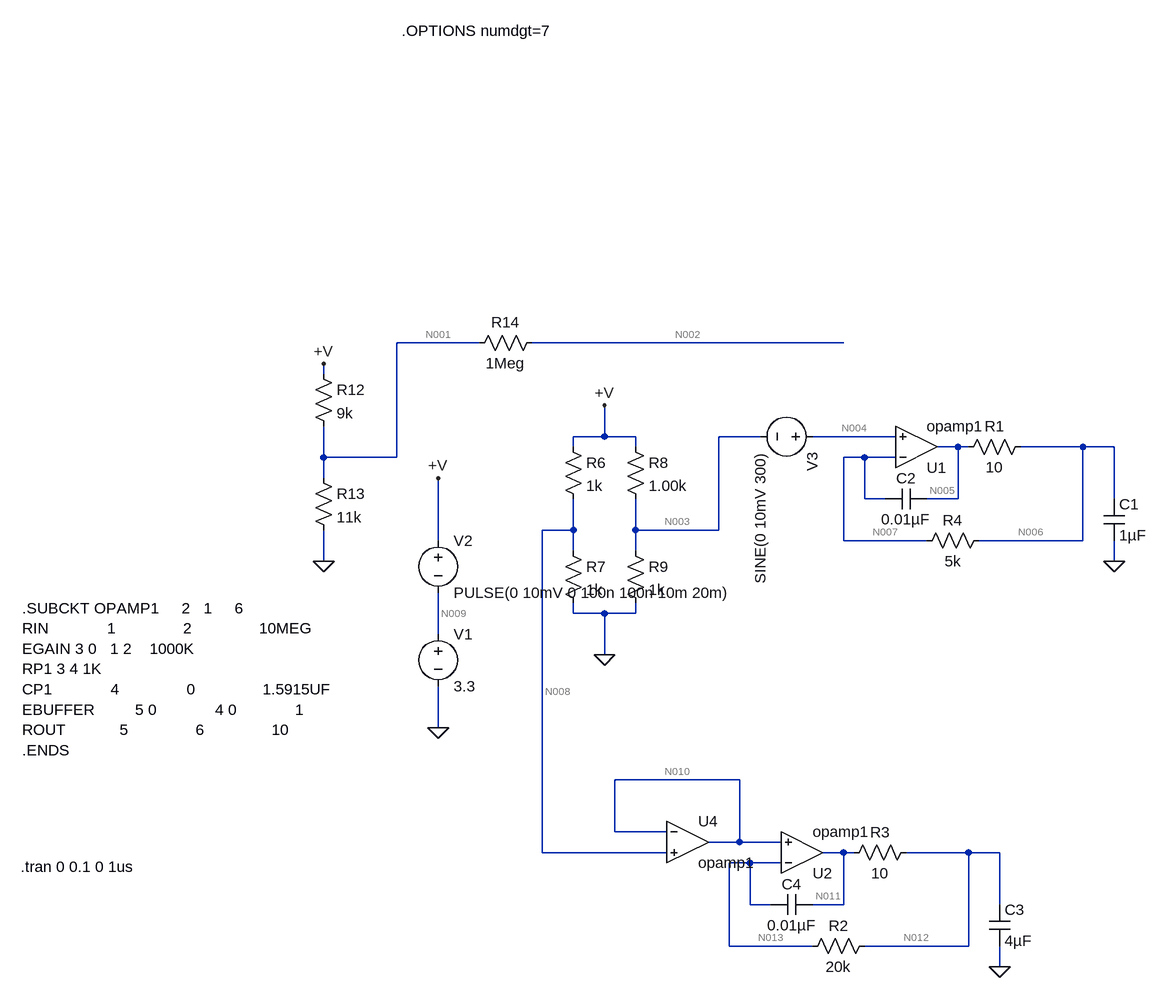
[diagram p0: schematic amp02.asc]
amp02.asc, the LTspice schematic file:
Version 4
SHEET 1 1124 732
WIRE -352 -272 -480 -272
WIRE 208 -272 -272 -272
WIRE -592 -224 -592 -240
WIRE -160 -128 -160 -176
WIRE -160 -128 -208 -128
WIRE -112 -128 -160 -128
WIRE 80 -128 16 -128
WIRE 288 -128 160 -128
WIRE -208 -112 -208 -128
WIRE -112 -112 -112 -128
WIRE 384 -112 352 -112
WIRE 400 -112 384 -112
WIRE 576 -112 480 -112
WIRE 624 -112 576 -112
WIRE -592 -96 -592 -144
WIRE -480 -96 -480 -272
WIRE -480 -96 -592 -96
WIRE 240 -96 208 -96
WIRE 288 -96 240 -96
WIRE -592 -64 -592 -96
WIRE 240 -32 240 -96
WIRE 272 -32 240 -32
WIRE 384 -32 384 -112
WIRE 384 -32 336 -32
WIRE 624 -32 624 -112
WIRE -208 16 -208 -32
WIRE -208 16 -256 16
WIRE -112 16 -112 -32
WIRE 16 16 16 -128
WIRE 16 16 -112 16
WIRE -416 32 -416 -64
WIRE 208 32 208 -96
WIRE 336 32 208 32
WIRE 576 32 576 -112
WIRE 576 32 416 32
WIRE -208 48 -208 16
WIRE -112 48 -112 16
WIRE -592 64 -592 16
WIRE 624 64 624 32
WIRE -208 144 -208 128
WIRE -160 144 -208 144
WIRE -112 144 -112 128
WIRE -112 144 -160 144
WIRE -416 176 -416 112
WIRE -160 208 -160 144
WIRE -416 320 -416 256
WIRE 48 400 -144 400
WIRE -144 480 -144 400
WIRE -64 480 -144 480
WIRE 48 496 48 400
WIRE 48 496 0 496
WIRE 112 496 48 496
WIRE -256 512 -256 16
WIRE -64 512 -256 512
WIRE 208 512 176 512
WIRE 224 512 208 512
WIRE 400 512 304 512
WIRE 448 512 400 512
WIRE 64 528 32 528
WIRE 112 528 64 528
WIRE 64 592 64 528
WIRE 96 592 64 592
WIRE 208 592 208 512
WIRE 208 592 160 592
WIRE 448 592 448 512
WIRE 32 656 32 528
WIRE 160 656 32 656
WIRE 400 656 400 512
WIRE 400 656 240 656
WIRE 448 688 448 656
FLAG -416 -64 +V
FLAG -416 320 0
FLAG -160 208 0
FLAG -160 -176 +V
FLAG -592 64 0
FLAG -592 -240 +V
FLAG 624 64 0
FLAG 448 688 0
SYMBOL res 432 16 R90
WINDOW 0 0 56 VBottom 2
WINDOW 3 32 56 VTop 2
SYMATTR InstName R4
SYMATTR Value 5k
SYMBOL voltage -416 160 R0
WINDOW 123 0 0 Left 2
WINDOW 39 0 0 Left 2
SYMATTR InstName V1
SYMATTR Value 3.3
SYMBOL res -224 -128 R0
SYMATTR InstName R6
SYMATTR Value 1k
SYMBOL res -224 32 R0
SYMATTR InstName R7
SYMATTR Value 1k
SYMBOL res -128 -128 R0
SYMATTR InstName R8
SYMATTR Value 1.00k
SYMBOL res -128 32 R0
SYMATTR InstName R9
SYMATTR Value 1k
SYMBOL Opamps\\opamp 320 -48 M180
SYMATTR InstName U1
SYMATTR SpiceLine ""
SYMATTR Value opamp1
SYMATTR SpiceLine2 ""
SYMBOL Opamps\\opamp -32 432 R0
SYMATTR InstName U4
SYMATTR SpiceLine ""
SYMATTR Value opamp1
SYMATTR SpiceLine2 ""
SYMBOL voltage -416 16 R0
WINDOW 123 0 0 Left 2
WINDOW 39 0 0 Left 2
SYMATTR InstName V2
SYMATTR Value PULSE(0 10mV 0 100n 100n 10m 20m)
SYMBOL res -608 -240 R0
SYMATTR InstName R12
SYMATTR Value 9k
SYMBOL res -608 -80 R0
SYMATTR InstName R13
SYMATTR Value 11k
SYMBOL res -256 -288 R90
WINDOW 0 0 56 VBottom 2
WINDOW 3 32 56 VTop 2
SYMATTR InstName R14
SYMATTR Value 1Meg
SYMBOL cap 608 -32 R0
SYMATTR InstName C1
SYMATTR Value 1µF
SYMBOL res 496 -128 R90
WINDOW 0 0 56 VBottom 2
WINDOW 3 32 56 VTop 2
SYMATTR InstName R1
SYMATTR Value 10
SYMBOL cap 336 -48 R90
WINDOW 0 0 32 VBottom 2
WINDOW 3 32 32 VTop 2
SYMATTR InstName C2
SYMATTR Value 0.01µF
SYMBOL voltage 176 -128 R90
WINDOW 123 0 0 Left 2
WINDOW 39 0 0 Left 2
SYMATTR InstName V3
SYMATTR Value SINE(0 10mV 300)
SYMBOL res 256 640 R90
WINDOW 0 0 56 VBottom 2
WINDOW 3 32 56 VTop 2
SYMATTR InstName R2
SYMATTR Value 20k
SYMBOL Opamps\\opamp 144 576 M180
SYMATTR InstName U2
SYMATTR SpiceLine ""
SYMATTR Value opamp1
SYMATTR SpiceLine2 ""
SYMBOL cap 432 592 R0
SYMATTR InstName C3
SYMATTR Value 4µF
SYMBOL res 320 496 R90
WINDOW 0 0 56 VBottom 2
WINDOW 3 32 56 VTop 2
SYMATTR InstName R3
SYMATTR Value 10
SYMBOL cap 160 576 R90
WINDOW 0 0 32 VBottom 2
WINDOW 3 32 32 VTop 2
SYMATTR InstName C4
SYMATTR Value 0.01µF
TEXT -1056 136 Left 2 !.SUBCKT OPAMP1     2   1     6\nRIN             1               2               10MEG\nEGAIN 3 0   1 2    1000K\nRP1 3 4 1K\nCP1             4               0               1.5915UF\nEBUFFER         5 0             4 0             1\nROUT            5               6               10\n.ENDS
TEXT -472 -752 Left 2 !.OPTIONS numdgt=7
TEXT -1058 534 Left 2 !.tran 0 0.1 0 1us

The netlist it stands for:
* amp02.asc
R4 N006 N007 5k
V1 N009 0 3.3
R6 +V N008 1k
R7 N008 0 1k
R8 +V N003 1.00k
R9 N003 0 1k
XU1 N007 N004 N005 opamp1  ; pins invin noninvin out
XU4 N010 N008 N010 opamp1  ; pins invin noninvin out
V2 +V N009 PULSE(0 10mV 0 100n 100n 10m 20m)
R12 +V N001 9k
R13 N001 0 11k
R14 N002 N001 1Meg
C1 N006 0 1µF
R1 N006 N005 10
C2 N005 N007 0.01µF
V3 N004 N003 SINE(0 10mV 300)
R2 N012 N013 20k
XU2 N013 N010 N011 opamp1  ; pins invin noninvin out
C3 N012 0 4µF
R3 N012 N011 10
C4 N011 N013 0.01µF
.SUBCKT OPAMP1     2   1     6
RIN             1               2               10MEG
EGAIN 3 0   1 2    1000K
RP1 3 4 1K
CP1             4               0               1.5915UF
EBUFFER         5 0             4 0             1
ROUT            5               6               10
.ENDS
.OPTIONS numdgt=7
.tran 0 0.1 0 1us
.backanno
.end

* Results of the author's LTspice run, read from the files saved beside the schematic
* Operating Point, zero values left out:
*   V(n006) = 1.65 V
*   V(n007) = 1.65 V
*   V(n009) = 3.3 V
*   V(+v) = 3.3 V
*   V(n008) = 1.65 V
*   V(n003) = 1.65 V
*   V(n004) = 1.65 V
*   V(n005) = 1.65 V
*   V(n010) = 1.65 V
*   V(n001) = 1.815 V
*   V(n002) = 1.815 V
*   V(n012) = 1.65 V
*   V(n013) = 1.65 V
*   V(n011) = 1.65 V
*   I(R13) = 165 µA
*   I(R12) = 165 µA
*   I(R9) = 1.65 mA
*   I(R8) = 1.65 mA
*   I(R7) = 1.65 mA
*   I(R6) = 1.65 mA
*   I(V2) = -3.465 mA
*   I(V1) = -3.465 mA
*   Ix(u1:6) = -23.28 pA
*   Ix(u4:6) = 8.306 pA
*   Ix(u2:6) = 23.28 pA